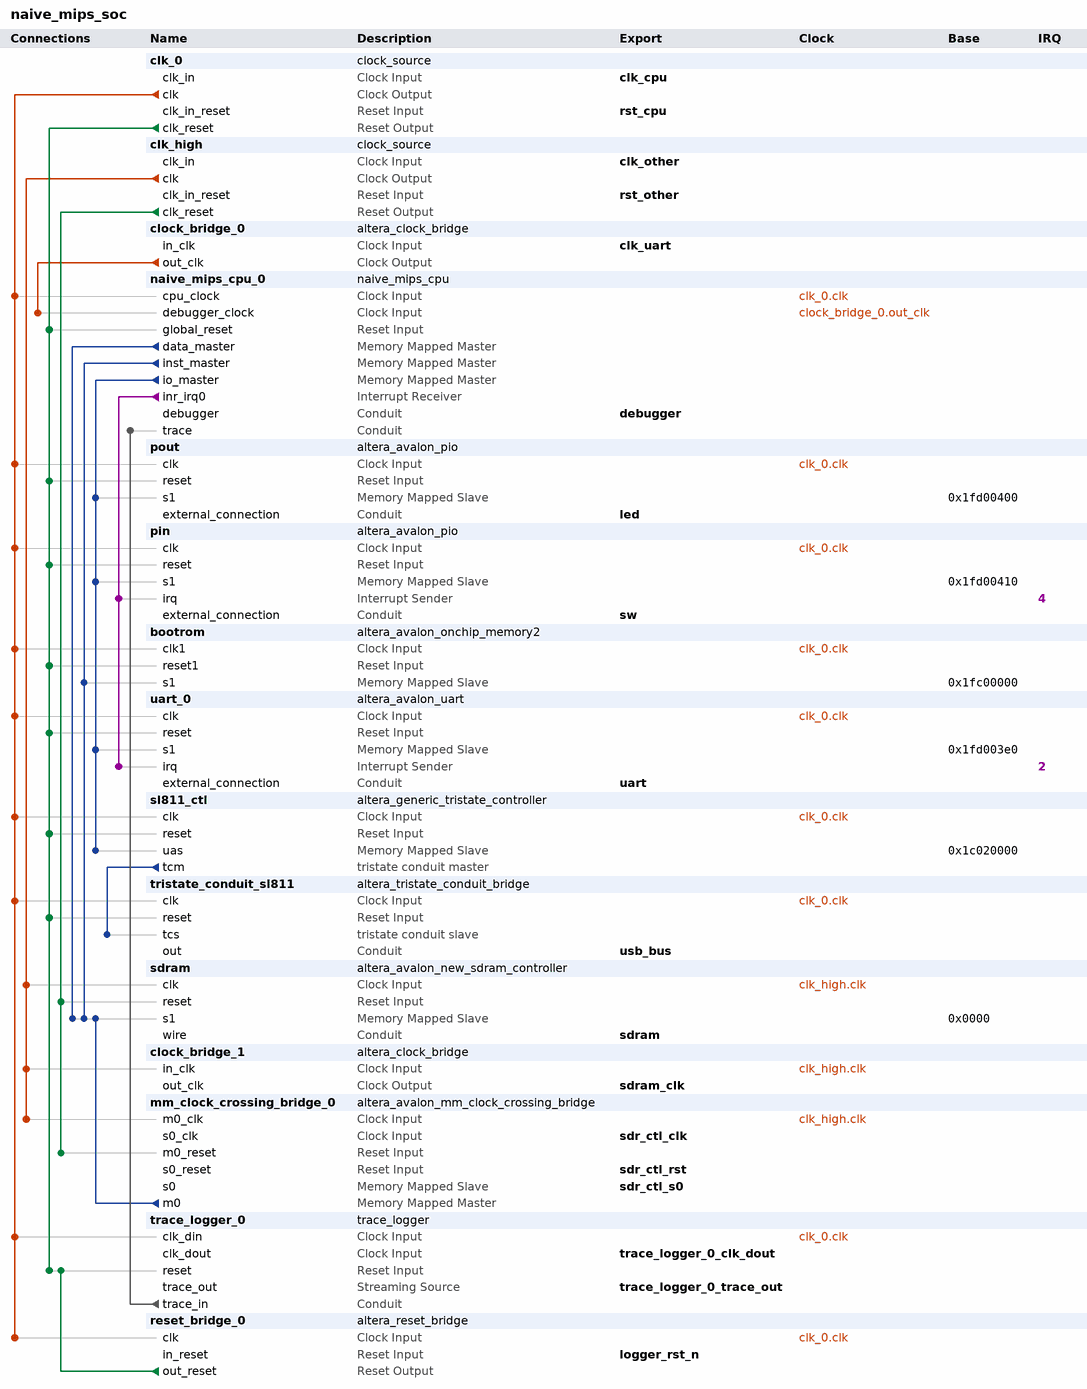
[diagram p0: system contents]
# Platform Designer (Qsys) system naive_mips_soc, Cyclone V 5CSEMA5F31C6
# Parameters at their usual value, and those the tool derives, are not listed.
package require -exact qsys 15.1
create_system naive_mips_soc
set_project_property DEVICE_FAMILY {Cyclone V}
set_project_property DEVICE 5CSEMA5F31C6

add_instance clk_0 clock_source 15.1
set_instance_parameter_value clk_0 clockFrequency 30000000
set_instance_parameter_value clk_0 resetSynchronousEdges DEASSERT

add_instance clk_high clock_source 15.1
set_instance_parameter_value clk_high clockFrequency 150000000
set_instance_parameter_value clk_high resetSynchronousEdges DEASSERT

add_instance clock_bridge_0 altera_clock_bridge 15.1
set_instance_parameter_value clock_bridge_0 DERIVED_CLOCK_RATE 0
set_instance_parameter_value clock_bridge_0 EXPLICIT_CLOCK_RATE 0

add_instance naive_mips_cpu_0 naive_mips_cpu 1.0

add_instance pout altera_avalon_pio 15.1
set_instance_parameter_value pout direction Output
set_instance_parameter_value pout width 32

add_instance pin altera_avalon_pio 15.1
set_instance_parameter_value pin direction Input
set_instance_parameter_value pin generateIRQ true
set_instance_parameter_value pin simDoTestBenchWiring true
set_instance_parameter_value pin width 32

add_instance bootrom altera_avalon_onchip_memory2 15.1
set_instance_parameter_value bootrom allowInSystemMemoryContentEditor true
set_instance_parameter_value bootrom dataWidth 32
set_instance_parameter_value bootrom dualPort false
set_instance_parameter_value bootrom initMemContent true
set_instance_parameter_value bootrom initializationFileName E:/Projects/NaiveMIPS-HDL/altera/bootrom.mif
set_instance_parameter_value bootrom instanceID BOOT
set_instance_parameter_value bootrom memorySize 8192
set_instance_parameter_value bootrom resetrequest_enabled false
set_instance_parameter_value bootrom useNonDefaultInitFile true
set_instance_parameter_value bootrom writable false

add_instance uart_0 altera_avalon_uart 15.1
set_instance_parameter_value uart_0 baud 115200
set_instance_parameter_value uart_0 dataBits 8
set_instance_parameter_value uart_0 fixedBaud true
set_instance_parameter_value uart_0 parity NONE
set_instance_parameter_value uart_0 stopBits 1

add_instance sl811_ctl altera_generic_tristate_controller 15.1
set_instance_parameter_value sl811_ctl ACTIVE_LOW_BEGINTRANSFER 0
set_instance_parameter_value sl811_ctl ACTIVE_LOW_BYTEENABLE 0
set_instance_parameter_value sl811_ctl ACTIVE_LOW_OUTPUTENABLE 0
set_instance_parameter_value sl811_ctl ACTIVE_LOW_READ 1
set_instance_parameter_value sl811_ctl ACTIVE_LOW_RESET_OUTPUT 1
set_instance_parameter_value sl811_ctl CHIPSELECT_THROUGH_READLATENCY 0
set_instance_parameter_value sl811_ctl IS_MEMORY_DEVICE 0
set_instance_parameter_value sl811_ctl TCM_ADDRESS_W 3
set_instance_parameter_value sl811_ctl TCM_BYTEENABLE_W 4
set_instance_parameter_value sl811_ctl TCM_DATA_HOLD 1
set_instance_parameter_value sl811_ctl TCM_DATA_W 32
set_instance_parameter_value sl811_ctl TCM_MAX_PENDING_READ_TRANSACTIONS 1
set_instance_parameter_value sl811_ctl TCM_READLATENCY 2
set_instance_parameter_value sl811_ctl TCM_READ_WAIT 3
set_instance_parameter_value sl811_ctl TCM_SETUP_WAIT 0
set_instance_parameter_value sl811_ctl TCM_SYMBOLS_PER_WORD 4
set_instance_parameter_value sl811_ctl TCM_TIMING_UNITS 1
set_instance_parameter_value sl811_ctl TCM_TURNAROUND_TIME 3
set_instance_parameter_value sl811_ctl TCM_WRITE_WAIT 3
set_instance_parameter_value sl811_ctl USE_BEGINTRANSFER 0
set_instance_parameter_value sl811_ctl USE_BYTEENABLE 0
set_instance_parameter_value sl811_ctl USE_OUTPUTENABLE 0
set_instance_parameter_value sl811_ctl USE_READ 1
set_instance_parameter_value sl811_ctl USE_RESET_OUTPUT 1

add_instance tristate_conduit_sl811 altera_tristate_conduit_bridge 15.1

add_instance sdram altera_avalon_new_sdram_controller 15.1
set_instance_parameter_value sdram TAC 5.4
set_instance_parameter_value sdram TRCD 15.0
set_instance_parameter_value sdram TRP 15.0
set_instance_parameter_value sdram casLatency 3
set_instance_parameter_value sdram columnWidth 10
set_instance_parameter_value sdram dataWidth 16
set_instance_parameter_value sdram generateSimulationModel true
set_instance_parameter_value sdram model single_Micron_MT48LC4M32B2_7_chip
set_instance_parameter_value sdram numberOfBanks 4
set_instance_parameter_value sdram numberOfChipSelects 1
set_instance_parameter_value sdram powerUpDelay 100.0
set_instance_parameter_value sdram refreshPeriod 7.8125
set_instance_parameter_value sdram rowWidth 13

add_instance clock_bridge_1 altera_clock_bridge 15.1
set_instance_parameter_value clock_bridge_1 DERIVED_CLOCK_RATE 150000000
set_instance_parameter_value clock_bridge_1 EXPLICIT_CLOCK_RATE 0

add_instance mm_clock_crossing_bridge_0 altera_avalon_mm_clock_crossing_bridge 15.1
set_instance_parameter_value mm_clock_crossing_bridge_0 ADDRESS_WIDTH 10
set_instance_parameter_value mm_clock_crossing_bridge_0 COMMAND_FIFO_DEPTH 4
set_instance_parameter_value mm_clock_crossing_bridge_0 DATA_WIDTH 32
set_instance_parameter_value mm_clock_crossing_bridge_0 MASTER_SYNC_DEPTH 2
set_instance_parameter_value mm_clock_crossing_bridge_0 MAX_BURST_SIZE 1
set_instance_parameter_value mm_clock_crossing_bridge_0 RESPONSE_FIFO_DEPTH 4
set_instance_parameter_value mm_clock_crossing_bridge_0 SLAVE_SYNC_DEPTH 2
set_instance_parameter_value mm_clock_crossing_bridge_0 USE_AUTO_ADDRESS_WIDTH 1

add_instance trace_logger_0 trace_logger 1.0

add_instance reset_bridge_0 altera_reset_bridge 15.1
set_instance_parameter_value reset_bridge_0 ACTIVE_LOW_RESET 1
set_instance_parameter_value reset_bridge_0 SYNCHRONOUS_EDGES deassert

# connections
add_connection clk_0.clk bootrom.clk1 clock
add_connection clk_0.clk naive_mips_cpu_0.cpu_clock clock
add_connection clk_0.clk pin.clk clock
add_connection clk_0.clk pout.clk clock
add_connection clk_0.clk reset_bridge_0.clk clock
add_connection clk_0.clk sl811_ctl.clk clock
add_connection clk_0.clk trace_logger_0.clk_din clock
add_connection clk_0.clk tristate_conduit_sl811.clk clock
add_connection clk_0.clk uart_0.clk clock
add_connection clk_high.clk clock_bridge_1.in_clk clock
add_connection clk_high.clk mm_clock_crossing_bridge_0.m0_clk clock
add_connection clk_high.clk sdram.clk clock
add_connection clock_bridge_0.out_clk naive_mips_cpu_0.debugger_clock clock
add_connection clk_0.clk_reset bootrom.reset1 reset
add_connection clk_0.clk_reset naive_mips_cpu_0.global_reset reset
add_connection clk_0.clk_reset pin.reset reset
add_connection clk_0.clk_reset pout.reset reset
add_connection clk_0.clk_reset sl811_ctl.reset reset
add_connection clk_0.clk_reset trace_logger_0.reset reset
add_connection clk_0.clk_reset tristate_conduit_sl811.reset reset
add_connection clk_0.clk_reset uart_0.reset reset
add_connection clk_high.clk_reset mm_clock_crossing_bridge_0.m0_reset reset
add_connection clk_high.clk_reset sdram.reset reset
add_connection reset_bridge_0.out_reset trace_logger_0.reset reset
add_connection mm_clock_crossing_bridge_0.m0 sdram.s1 avalon
set_connection_parameter_value mm_clock_crossing_bridge_0.m0/sdram.s1 baseAddress 0x0000
add_connection naive_mips_cpu_0.data_master sdram.s1 avalon
set_connection_parameter_value naive_mips_cpu_0.data_master/sdram.s1 baseAddress 0x0000
add_connection naive_mips_cpu_0.inst_master bootrom.s1 avalon
set_connection_parameter_value naive_mips_cpu_0.inst_master/bootrom.s1 baseAddress 0x1fc00000
add_connection naive_mips_cpu_0.inst_master sdram.s1 avalon
set_connection_parameter_value naive_mips_cpu_0.inst_master/sdram.s1 baseAddress 0x0000
add_connection naive_mips_cpu_0.io_master pin.s1 avalon
set_connection_parameter_value naive_mips_cpu_0.io_master/pin.s1 baseAddress 0x1fd00410
add_connection naive_mips_cpu_0.io_master pout.s1 avalon
set_connection_parameter_value naive_mips_cpu_0.io_master/pout.s1 baseAddress 0x1fd00400
add_connection naive_mips_cpu_0.io_master sl811_ctl.uas avalon
set_connection_parameter_value naive_mips_cpu_0.io_master/sl811_ctl.uas baseAddress 0x1c020000
add_connection naive_mips_cpu_0.io_master uart_0.s1 avalon
set_connection_parameter_value naive_mips_cpu_0.io_master/uart_0.s1 baseAddress 0x1fd003e0
add_connection trace_logger_0.trace_in naive_mips_cpu_0.trace conduit
add_connection naive_mips_cpu_0.inr_irq0 pin.irq interrupt
set_connection_parameter_value naive_mips_cpu_0.inr_irq0/pin.irq irqNumber 4
add_connection naive_mips_cpu_0.inr_irq0 uart_0.irq interrupt
set_connection_parameter_value naive_mips_cpu_0.inr_irq0/uart_0.irq irqNumber 2
add_connection sl811_ctl.tcm tristate_conduit_sl811.tcs tristate_conduit

# exported interfaces
add_interface clk_cpu clock sink
set_interface_property clk_cpu EXPORT_OF clk_0.clk_in
add_interface clk_other clock sink
set_interface_property clk_other EXPORT_OF clk_high.clk_in
add_interface clk_uart clock sink
set_interface_property clk_uart EXPORT_OF clock_bridge_0.in_clk
add_interface debugger conduit end
set_interface_property debugger EXPORT_OF naive_mips_cpu_0.debugger
add_interface led conduit end
set_interface_property led EXPORT_OF pout.external_connection
add_interface logger_rst_n reset sink
set_interface_property logger_rst_n EXPORT_OF reset_bridge_0.in_reset
add_interface rst_cpu reset sink
set_interface_property rst_cpu EXPORT_OF clk_0.clk_in_reset
add_interface rst_other reset sink
set_interface_property rst_other EXPORT_OF clk_high.clk_in_reset
add_interface sdr_ctl_clk clock sink
set_interface_property sdr_ctl_clk EXPORT_OF mm_clock_crossing_bridge_0.s0_clk
add_interface sdr_ctl_rst reset sink
set_interface_property sdr_ctl_rst EXPORT_OF mm_clock_crossing_bridge_0.s0_reset
add_interface sdr_ctl_s0 avalon slave
set_interface_property sdr_ctl_s0 EXPORT_OF mm_clock_crossing_bridge_0.s0
add_interface sdram conduit end
set_interface_property sdram EXPORT_OF sdram.wire
add_interface sdram_clk clock source
set_interface_property sdram_clk EXPORT_OF clock_bridge_1.out_clk
add_interface sw conduit end
set_interface_property sw EXPORT_OF pin.external_connection
add_interface trace_logger_0_clk_dout clock sink
set_interface_property trace_logger_0_clk_dout EXPORT_OF trace_logger_0.clk_dout
add_interface trace_logger_0_trace_out avalon_streaming source
set_interface_property trace_logger_0_trace_out EXPORT_OF trace_logger_0.trace_out
add_interface uart conduit end
set_interface_property uart EXPORT_OF uart_0.external_connection
add_interface usb_bus conduit end
set_interface_property usb_bus EXPORT_OF tristate_conduit_sl811.out

set_interconnect_requirement {$system} qsys_mm.clockCrossingAdapter HANDSHAKE
set_interconnect_requirement {$system} qsys_mm.enableEccProtection FALSE
set_interconnect_requirement {$system} qsys_mm.insertDefaultSlave FALSE
set_interconnect_requirement {$system} qsys_mm.maxAdditionalLatency 1

save_system naive_mips_soc.qsys
